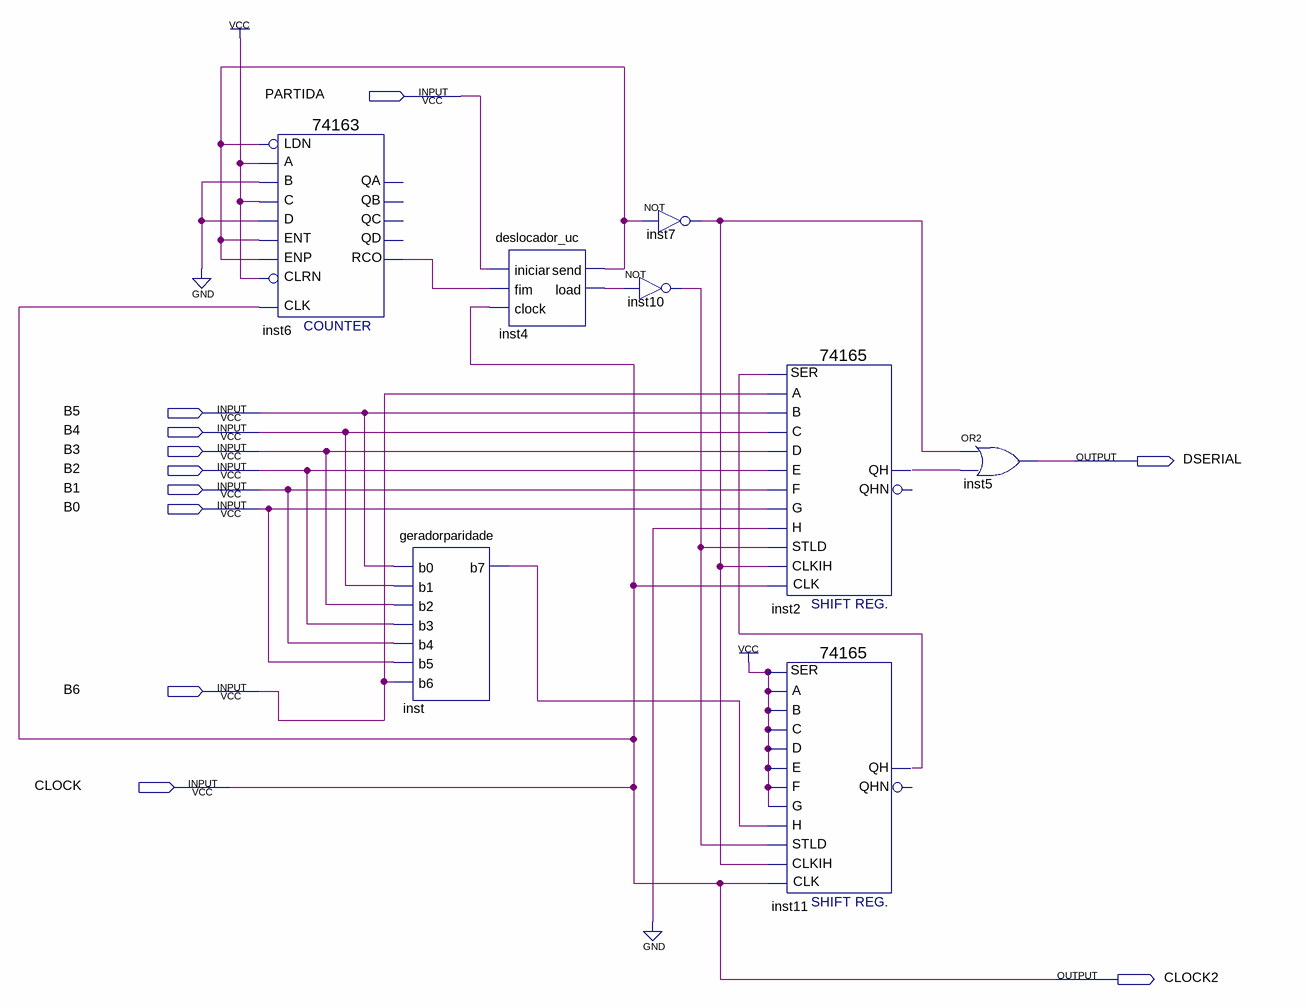
[diagram p0: schematic sheet]
// Quartus schematic serialassincrona.bdf as structural Verilog: 8 symbols, 11 pins
module serialassincrona (
  input  PARTIDA,
  input  B5,
  input  B4,
  input  B3,
  input  B2,
  input  B1,
  input  B0,
  input  B6,
  input  CLOCK,
  output DSERIAL,
  output CLOCK2
);

  wire inst2_qh, inst4_load, inst4_send, inst6_rco, inst7_out, inst10_out, inst11_qh, inst_b7;

  \74163  inst6 (
    .C(1'b1), .B(1'b0), .A(1'b1), .ENT(inst4_send), .D(1'b0), .CLRN(1'b1), .CLK(CLOCK), .ENP(inst4_send),
    .LDN(inst4_send), .RCO(inst6_rco));  // open: QA, QB, QC, QD
  geradorparidade inst (.b0(B5), .b1(B4), .b2(B3), .b3(B2), .b4(B1), .b5(B0), .b6(B6), .b7(inst_b7));
  deslocador_uc inst4 (.iniciar(PARTIDA), .fim(inst6_rco), .clock(CLOCK), .send(inst4_send), .load(inst4_load));
  not inst10 (inst10_out, inst4_load);
  not inst7 (inst7_out, inst4_send);
  \74165  inst2 (
    .D(B3), .C(B4), .B(B5), .G(B0), .H(1'b0), .A(B6), .CLKIH(inst7_out), .E(B2), .F(B1), .CLK(CLOCK),
    .STLD(inst10_out), .SER(inst11_qh), .QH(inst2_qh));  // open: QHN
  \74165  inst11 (
    .D(1'b1), .C(1'b1), .B(1'b1), .G(1'b1), .H(inst_b7), .A(1'b1), .CLKIH(inst7_out), .E(1'b1), .F(1'b1),
    .CLK(CLOCK), .STLD(inst10_out), .SER(1'b1), .QH(inst11_qh));  // open: QHN
  or inst5 (DSERIAL, inst7_out, inst2_qh);

  assign CLOCK2 = CLOCK;
endmodule
